# Altium project Control-Panel.PrjPcb
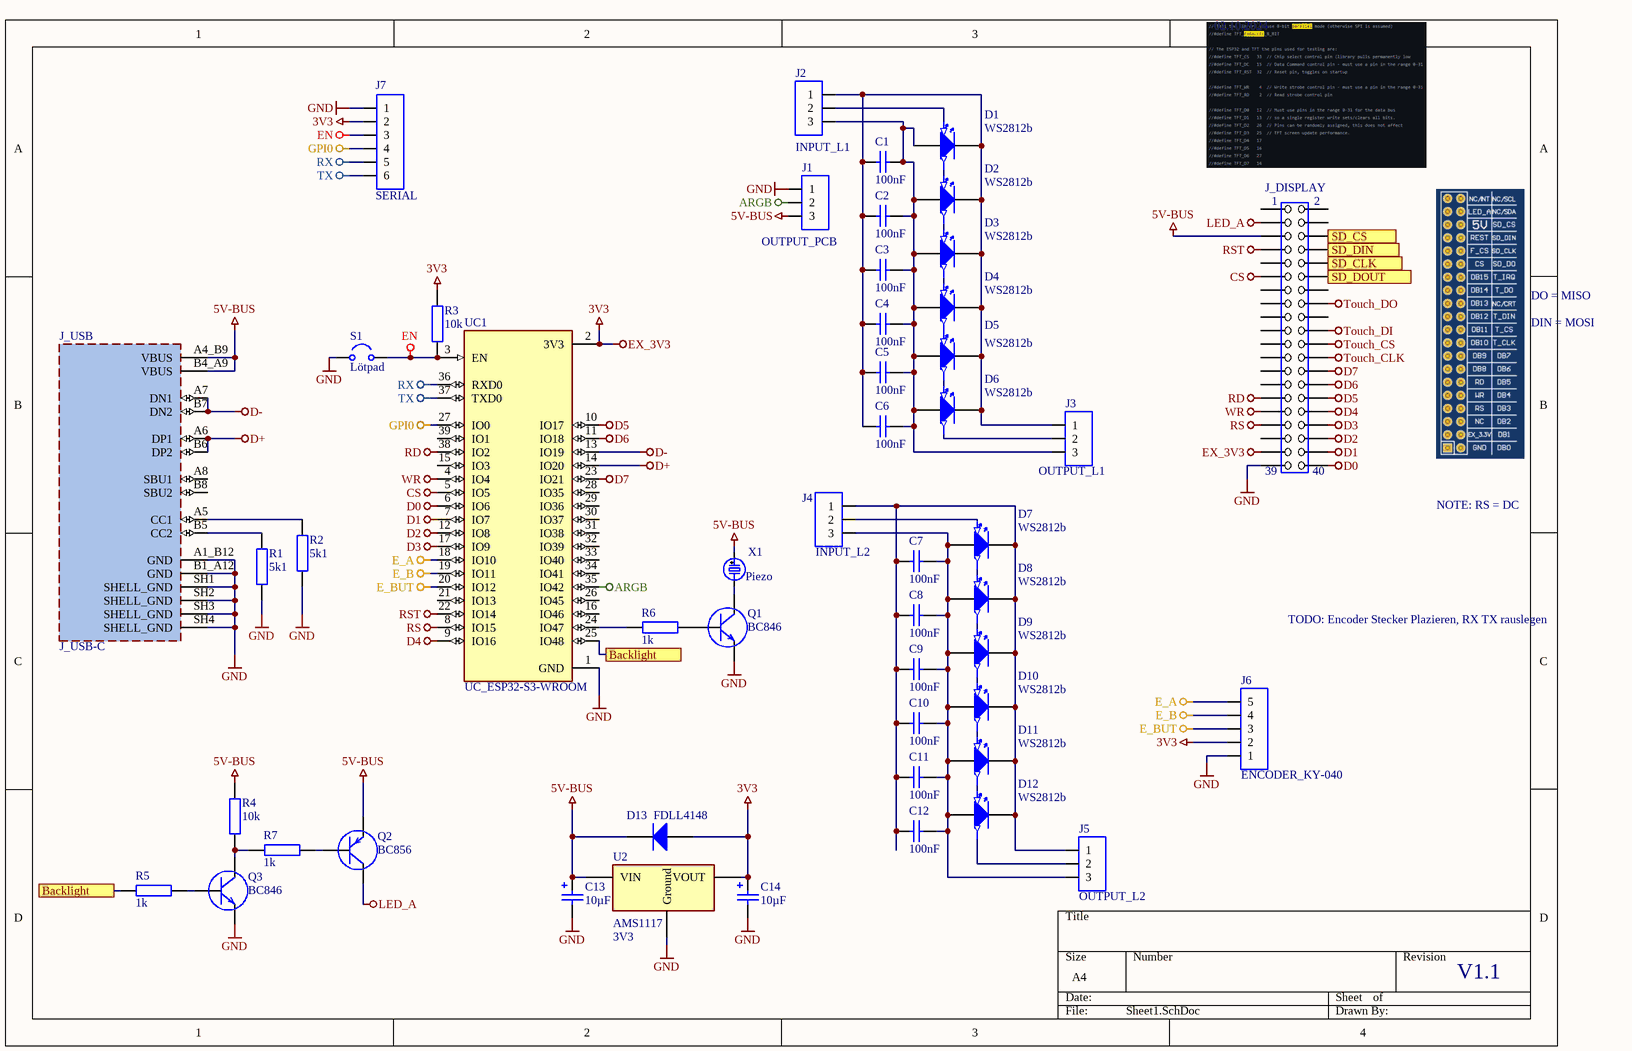
[diagram p0: Sheet1.SchDoc]
1 sheet, 50 parts. Net scope: flat (ports and power ports of the same name join across sheets).
Board file: PCB1.PcbDoc

## Sheet Sheet1.SchDoc
size A4; SheetNumber: 1; SheetTotal: 1

### Parts
C1  100nF  [C_SMD_0603]
C2  100nF  [C_SMD_0603]
C3  100nF  [C_SMD_0603]
C4  100nF  [C_SMD_0603]
C5  100nF  [C_SMD_0603]
C6  100nF  [C_SMD_0603]
C7  100nF  [C_SMD_0603]
C8  100nF  [C_SMD_0603]
C9  100nF  [C_SMD_0603]
C10  100nF  [C_SMD_0603]
C11  100nF  [C_SMD_0603]
C12  100nF  [C_SMD_0603]
C13  10µF  [C_SMD_B-Typ]
C14  10µF  [C_SMD_B-Typ]
D1  WS2812b  [D_SMD_LED-ARGB]
D2  WS2812b  [D_SMD_LED-ARGB]
D3  WS2812b  [D_SMD_LED-ARGB]
D4  WS2812b  [D_SMD_LED-ARGB]
D5  WS2812b  [D_SMD_LED-ARGB]
D6  WS2812b  [D_SMD_LED-ARGB]
D7  WS2812b  [D_SMD_LED-ARGB]
D8  WS2812b  [D_SMD_LED-ARGB]
D9  WS2812b  [D_SMD_LED-ARGB]
D10  WS2812b  [D_SMD_LED-ARGB]
D11  WS2812b  [D_SMD_LED-ARGB]
D12  WS2812b  [D_SMD_LED-ARGB]
D13  FDLL4148  [SOD-80-2]
J1  OUTPUT_PCB  [Sip-3]
J2  INPUT_L1  [Sip-3]
J3  OUTPUT_L1  [Sip-3]
J4  INPUT_L2  [Sip-3]
J5  OUTPUT_L2  [Sip-3]
J6  ENCODER_KY-040  [SIP-5]
J7  SERIAL  [SIP-6]
J_DISPLAY  DISPLAY  [J_2x20]  (value not drawn)
J_USB  J_USB-C  [GCT_USB4105-GF-A]
Q1  BC846  [SOT-23-3_BC846]
Q2  BC856  [SOT-23-3_BC856]
Q3  BC846  [SOT-23-3_BC846]
R1  5k1  [R_SMD_0805]
R2  5k1  [R_SMD_0805]
R3  10k  [R_SMD_0805]
R4  10k  [R_SMD_0805]
R5  1k  [R_SMD_0805]
R6  1k  [R_SMD_0805]
R7  1k  [R_SMD_0805]
S1  Lötpad  [S_SMD_Pad-NC]
U2  AMS1117  [U_SMD_AMS1117]
UC1  UC_ESP32-S3-WROOM  [XCVR_ESP32S3WROOM1N8R8]
X1  Piezo  [X_THT_PIEZZO]

### Ports
Backlight (see Sheet1[1D]), Backlight (see Sheet1[2C]), SD_CLK, SD_CS, SD_DIN, SD_DOUT

### Nets
3V3: C14.1 D13.1(A) J6.2 J7.2 J_DISPLAY.37 R3.2 U2.2(VOUT) UC1.2(3V3)  [also labelled EX_3V3]
5V-BUS: C13.1 D13.2(K) J1.3 J_DISPLAY.5 J_USB.A4_B9(VBUS) J_USB.B4_A9(VBUS) Q2.E R4.2 U2.3(VIN) X1.1
ARGB: J1.2 UC1.35(IO42)
CS: J_DISPLAY.11 UC1.5(IO5)
D0: J_DISPLAY.40 UC1.6(IO6)
D1: J_DISPLAY.38 UC1.7(IO7)
D2: J_DISPLAY.36 UC1.12(IO8)
D3: J_DISPLAY.34 UC1.17(IO9)
D4: J_DISPLAY.32 UC1.9(IO16)
D5: J_DISPLAY.30 UC1.10(IO17)
D6: J_DISPLAY.28 UC1.11(IO18)
D7: J_DISPLAY.26 UC1.23(IO21)
D+: J_USB.A6(DP1) J_USB.B6(DP2) UC1.14(IO20)
D-: J_USB.A7(DN1) J_USB.B7(DN2) UC1.13(IO19)
E_A: J6.5 UC1.18(IO10)
E_B: J6.4 UC1.19(IO11)
E_BUT: J6.3 UC1.20(IO12)
EN: J7.3 R3.1 S1.2 UC1.3(EN)
GND: C13.2 C14.2 J1.1 J6.1 J7.1 J_DISPLAY.39 J_USB.A1_B12(GND) J_USB.B1_A12(GND) J_USB.SH1(SHELL_GND) J_USB.SH2(SHELL_GND) J_USB.SH3(SHELL_GND) J_USB.SH4(SHELL_GND) Q1.E Q3.E R1.1 R2.1 S1.1 U2.1(Ground) UC1.1(GND)
GPI0: J7.4 UC1.27(IO0)
LED_A: J_DISPLAY.3 Q2.C
RD: J_DISPLAY.29 UC1.38(IO2)
RS: J_DISPLAY.33 UC1.8(IO15)
RST: J_DISPLAY.7 UC1.22(IO14)
RX: J7.5 UC1.36(RXD0)
Touch_CLK: J_DISPLAY.24
Touch_CS: J_DISPLAY.22
Touch_DI: J_DISPLAY.20
Touch_DO: J_DISPLAY.16
TX: J7.6 UC1.37(TXD0)
WR: J_DISPLAY.31 UC1.4(IO4)
NetC1_1: C1.1 C2.1 C3.1 C4.1 C5.1 C6.1 D1.3(GND) D2.3(GND) D3.3(GND) D4.3(GND) D5.3(GND) D6.3(GND) J2.1 J3.1
NetC1_2: C1.2 C2.2 C3.2 C4.2 C5.2 C6.2 D1.1(VDD) D2.1(VDD) D3.1(VDD) D4.1(VDD) D5.1(VDD) D6.1(VDD) J2.3 J3.3
NetC7_1: C7.1 C8.1 C9.1 C10.1 C11.1 C12.1 D7.3(GND) D8.3(GND) D9.3(GND) D10.3(GND) D11.3(GND) D12.3(GND) J4.1 J5.1
NetC7_2: C7.2 C8.2 C9.2 C10.2 C11.2 C12.2 D7.1(VDD) D8.1(VDD) D9.1(VDD) D10.1(VDD) D11.1(VDD) D12.1(VDD) J4.3 J5.3
NetD1_2: D1.2(DOUT) D2.4(DIN)
NetD1_4: D1.4(DIN) J2.2
NetD2_2: D2.2(DOUT) D3.4(DIN)
NetD3_2: D3.2(DOUT) D4.4(DIN)
NetD4_2: D4.2(DOUT) D5.4(DIN)
NetD5_2: D5.2(DOUT) D6.4(DIN)
NetD6_2: D6.2(DOUT) J3.2
NetD7_2: D7.2(DOUT) D8.4(DIN)
NetD7_4: D7.4(DIN) J4.2
NetD8_2: D8.2(DOUT) D9.4(DIN)
NetD9_2: D9.2(DOUT) D10.4(DIN)
NetD10_2: D10.2(DOUT) D11.4(DIN)
NetD11_2: D11.2(DOUT) D12.4(DIN)
NetD12_2: D12.2(DOUT) J5.2
NetJ_DISPLAY_6: J_DISPLAY.6 ; port SD_CS
NetJ_DISPLAY_8: J_DISPLAY.8 ; port SD_DIN
NetJ_DISPLAY_10: J_DISPLAY.10 ; port SD_CLK
NetJ_DISPLAY_12: J_DISPLAY.12 ; port SD_DOUT
NetJ_USB_A5: J_USB.A5(CC1) R2.2
NetJ_USB_B5: J_USB.B5(CC2) R1.2
NetQ1_B: Q1.B R6.1
NetQ1_C: Q1.C X1.2
NetQ2_B: Q2.B R7.1
NetQ3_B: Q3.B R5.1
NetQ3_C: Q3.C R4.1 R7.2
NetR5_2: R5.2 UC1.25(IO48) ; port Backlight
NetR6_2: R6.2 UC1.24(IO47)

Not connected (* = marked no-connect by the designer): J_DISPLAY 1 2 4 9 13 14 15 17 18 19 21 23 25 27 35; J_USB A8(SBU1) B8(SBU2); UC1 15(IO3) 16(IO46) 21(IO13) 26(IO45) 28(IO35) 29(IO36) 30(IO37) 31(IO38) 32(IO39) 33(IO40) 34(IO41) 39(IO1)

### Notes on the sheet
- 02.10.2024
- DIN = MOSI
- DO = MISO
- NOTE: RS = DC
- TODO: Encoder Stecker Plazieren, RX TX rauslegen
- (near U2) 3V3
- V1.1

### Library data of the parts
C1-C12 = C_SMD_KO: Kondensator SMD Universal, Keramik, Folie, usw.; Spannung: *; Bauform: *; Typ: *
C13 C14 = C_SMD_ELK: SMD Elektrolytkondensator; Spannung: *; Bauform: *; Typ: *
D1-D12 = D_SMD_LED-ARGB: Diode SMD ARGB
D13 = D_SMD_Silizium: Diode SMD Silizium; Spannung For.: 0,7V; Spannung Rev.: *; Strom: *
J1-J5 = J_THT_CON3: Stecker
J6 = J_THT_CON5: Stecker
J7 = J_THT_CON6: Stecker
J_DISPLAY = J_THT_IDC 2x20: IDC-Con 2x20
J_USB = J_USB-C: USB4105-GF-; MF: {'manufacturer': u'GCT'}; MP: USB4105-GF-A; Package: None; Price: None; Value: *; Availability: Unavailable
Q1 Q3 = Q_SMD_NPN: NPN Transistor
Q2 = Q_SMD_PNP: PNP Transistor
R1-R7 = R_SMD_Widerstand: Widerstand SMD
S1 = S_SMD_Jumper: Lötverbinder
U2 = U_SMD_AMS1117: Linearwandler; Manufacturer Part Number: AMS1117-3.3; Manufacturer: Advanced Monolithic Systems; Dropout Voltage: 1.1V; Output Type: Fixed; Nominal Supply Current: 5mA; Output Current: 1A; Output Voltage: 3.3V; Max Power Dissipation: 1.2W; Max Supply Voltage: 15V; Number Of Outputs: 1; Standoff Height: 0.64mm; Max Junction Temp: +125°C; Height: 1.8mm; Package: AMS1117; Device Class L2: Power Management ICs; ComponentLink2Description: Datasheet; ComponentLink2URL: http://www.advanced-monolithic.com/pdf/ds1117.pdf; Category: IC; RoHS: TRUE; Automotive: No; Device Class L1: Integrated Circuits (ICs); Device Class L3: Voltage Regulators - Linear; Temperature: -40°C to +125°C; Temperature Range Low: -40°C; Octopart: https://octopart.com/ams1117-3.3-advanced+monolithic+systems-25899300; Lead Free: Yes; Ipc Land Pattern Name: SOT229P700X180-4; Temperature Range High: +125°C
UC1 = UC_ESP32-S3-WROOM: Bluetooth, WiFi 802.11b/g/n, Bluetooth v5.0 Transceiver Module 2.4GHz PCB Trace Surface Mount; MF: Espressif Systems; MP: ESP32-S3-WROOM-1-N8R8; Package: None; Price: None; Check_prices: https://www.snapeda.com/parts/ESP32-S3-WROOM-1-N8R8/Espressif+Systems/view-part/?ref=eda; Value: *; SnapEDA_Link: https://www.snapeda.com/parts/ESP32-S3-WROOM-1-N8R8/Espressif+Systems/view-part/?ref=snap; Availability: In Stock; Purchase-URL: https://pricing.snapeda.com/search?q=ESP32-S3-WROOM-1-N8R8&ref=eda
X1 = X_THT_Piezo: Piezobuzzer